# EAGLE design Intar_RGB_Module (EAGLE 7.3.0)
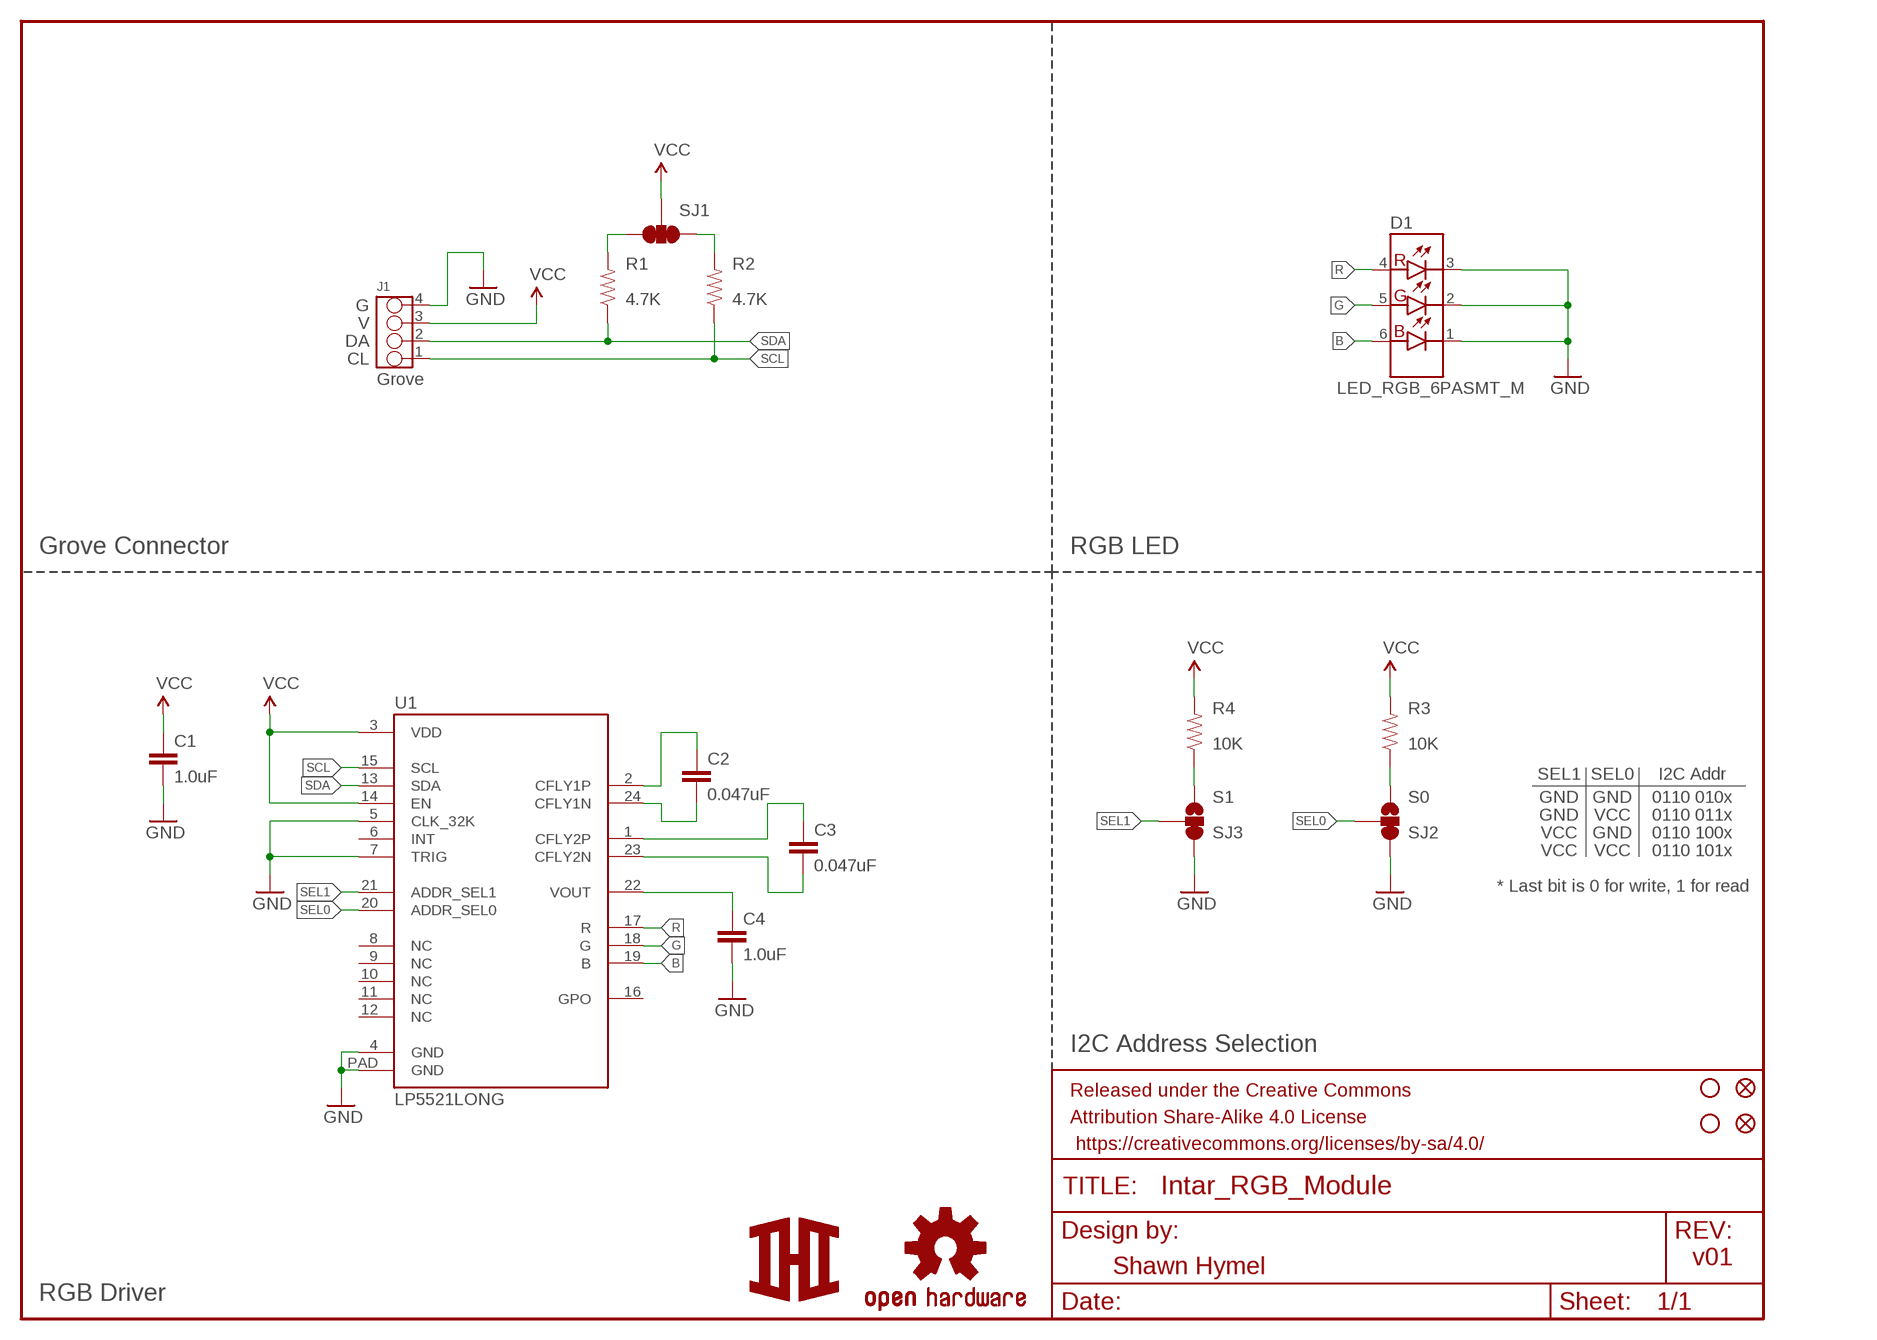
[diagram p0: schematic, sheet 1]

## Parts
C1  1.0uF  1.0UF-16V-10%(0603)  [0603-CAP]
C2  0.047uF  CAP0603-CAP  [0603-CAP]
C3  0.047uF  CAP0603-CAP  [0603-CAP]
C4  1.0uF  1.0UF-16V-10%(0603)  [0603-CAP]
D1  LED_RGB_6PASMT_M  [ASMT-YTB7-0AA02_M]
FID1  FIDUCIAL1X2  [FIDUCIAL-1X2]
FID2  FIDUCIAL1X2  [FIDUCIAL-1X2]
FRAME1  FRAME-LETTER  [CREATIVE_COMMONS]
J1  GROVE-4P-2.0-3470130P1  [4P-2.0]
LOGO1  OSHW-LOGOS  [OSHW-LOGO-S]
R1  4.7K  4.7KOHM-1/10W-1%(0603)  [0603-RES]
R2  4.7K  4.7KOHM-1/10W-1%(0603)  [0603-RES]
R3  10K  10KOHM-1/10W-1%(0603)0603  [0603-RES]
R4  10K  10KOHM-1/10W-1%(0603)0603  [0603-RES]
SJ1  SOLDERJUMPER_2WAYPASTE1&2&3  [SJ_3_PASTE1&2&3]
SJ2  SOLDERJUMPER_2WAYPASTE2&3  [SJ_3_PASTE2&3]
SJ3  SOLDERJUMPER_2WAYPASTE2&3  [SJ_3_PASTE2&3]
STANDOFF1  STAND-OFF  [STAND-OFF]
STANDOFF2  STAND-OFF  [STAND-OFF]
U1  LP5521LONG  [WQFN-24_LONG]
U$1  LOGOSM  [LOGO_SM]

## Nets
B: D1.6(B_A) U1.19(B)
G: D1.5(G_A) U1.18(G)
GND: C1.2 C4.2 D1.1(B_C) D1.2(G_C) D1.3(R_C) J1.4 SJ2.3 SJ3.3 U1.4(GND) U1.5(CLK_32K) U1.7(TRIG) U1.PAD(GND)
N$1: C2.1 U1.2(CFLY1P)
N$2: C2.2 U1.24(CFLY1N)
N$3: C3.1 U1.1(CFLY2P)
N$4: C3.2 U1.23(CFLY2N)
N$5: C4.1 U1.22(VOUT)
N$6: R1.2 SJ1.3
N$7: R2.2 SJ1.1
N$9: R3.1 SJ2.1
N$10: R4.1 SJ3.1
R: D1.4(R_A) U1.17(R)
SCL: J1.1 R2.1 U1.15(SCL)
SDA: J1.2 R1.1 U1.13(SDA)
SEL0: SJ2.2 U1.20(ADDR_SEL0)
SEL1: SJ3.2 U1.21(ADDR_SEL1)
VCC: C1.1 J1.3 R3.2 R4.2 SJ1.2 U1.3(VDD) U1.14(EN)
Unconnected: U1.6(INT) U1.8(NC) U1.9(NC) U1.10(NC) U1.11(NC) U1.12(NC) U1.16(GPO)

## Notes on the sheet
- G
- V
- DA
- CL
- Grove
- Grove Connector | RGB LED
- SEL1 | SEL0 | I2C Addr
- S1 | S0 | GND | GND | 0110 010x
- GND | VCC | 0110 011x
- VCC | GND | 0110 100x
- VCC | VCC | 0110 101x
- * Last bit is 0 for write, 1 for read
- I2C Address Selection
- v01
- Shawn Hymel
- RGB Driver

## Library data of the parts
C1 C4 = SparkFun-Capacitors:1.0UF-16V-10%(0603): CAP-00868; PROD_ID: CAP-00868
C2 C3 = SparkFun-Capacitors:CAP: Capacitor Standard 0603 ceramic capacitor, and 0.1" leaded capacitor.
D1 = Intar_Eagle_Library:LED_RGB_6P
FID1 FID2 = SparkFun-Aesthetics:FIDUCIAL: Fiducial Alignment Points Various fiducial points for machine vision alignment.
FRAME1 = SparkFun-Aesthetics:FRAME-LETTER: Schematic Frame Standard 8.5x11 US Letter frame
J1 = Connector:GROVE-4P-2.0
LOGO1 = SparkFun-Aesthetics:OSHW-LOGO: Open Source Hardware Logo This logo indicates the piece of hardware it is found on incorporates a OSHW license and/or adheres to the definition of open source hardware found here: http://freedomdefined.org/OSHW
R1 R2 = SparkFun-Resistors:4.7KOHM-1/10W-1%(0603): RES-07857; PROD_ID: RES-07857
R3 R4 = SparkFun-Resistors:10KOHM-1/10W-1%(0603): RES-00824; PROD_ID: RES-00824
SJ1-SJ3 = SparkFun-Retired:SOLDERJUMPER_2WAY: Solder Jumper 2 way solder jumper
STANDOFF1 STANDOFF2 = SparkFun-Electromechanical:STAND-OFF: #4 Stand Off This is the mechanical footprint for a #4 phillips button head screw. Use the keepout ring to avoid running the screw head into surrounding components. SKU : PRT-00447
U1 = Intar_Eagle_Library:LP5521
U$1 = Intar_Eagle_Library:LOGO

## Board
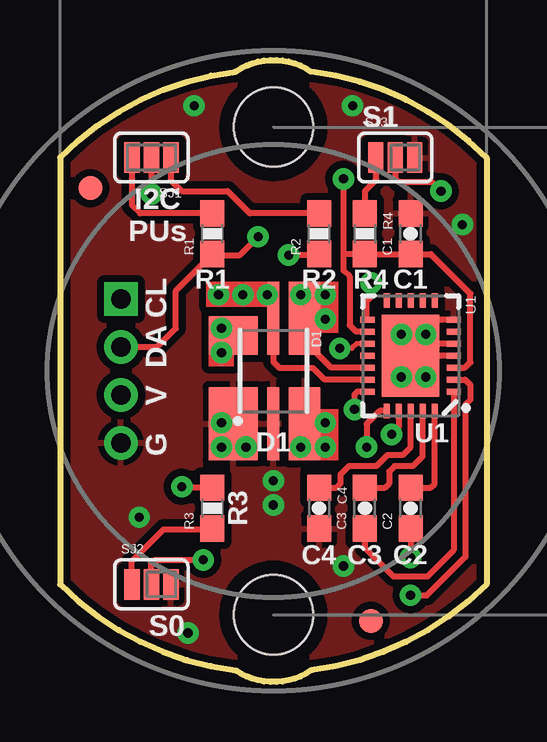
[diagram p1: board, top side]
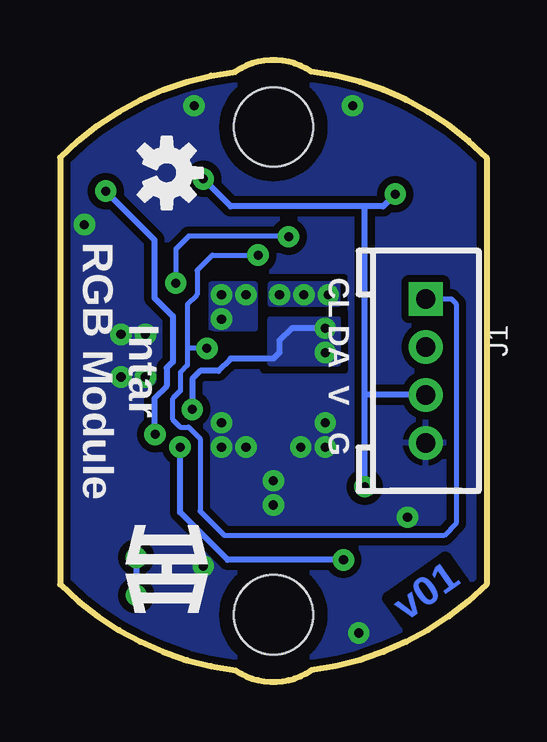
[diagram p2: board, bottom side, seen from below]

Size 17.78 x 25.91 mm. Coordinates in mm from the lower left corner, seen from the top.
Outline: 17.78,21.85 17.78,4.07 arc-38 10.46,0.48 arc-69 7.32,0.48 arc-38 0,4.07 0,21.85 arc-38 7.32,25.43 arc-69 10.46,25.43 arc-38 17.78,21.85
Copper layers (1*16): Top 0.035mm / dielectric 1.5mm / Bottom 0.035mm
Design rules "SparkFun-2-layer": minimum track width 7mil, minimum drill 15mil, track to track 8mil, track to pad 8mil, pad to pad 8mil, via to via 8mil, smd to smd 8mil, copper to edge 8mil, drill to drill 8mil, minimum pad ring 12mil, minimum via ring 10mil, stop-mask expansion 4mil, vias tented up to drill 20mil, thermal gap 10mil
tRestrict: area 16.2,13.8 to 16.6,13.9

### Footprints (pad centres in the part's own frame; a part is rotated, then mirrored left to right if it is on the bottom)
0603-CAP = smd 1.1 x 1: 1 -0.85,0; 2 0.85,0
ASMT-YTB7-0AA02_M = smd 3.05 x 2.05: 1 2.2,-1.675 | smd 3.05 x 0.5: 2 2.2,0; 5 -2.2,0 | smd 3.05 x 1.3: 3 2.2,1.3; 4 -2.2,1.3 | smd 1.6 x 2.05: 6 -1.475,-1.675
FIDUCIAL-1X2 = smd 1 x 1: 1 0,0
4P-2.0 = drill 0.8 pad 1.27 square: 1 -3,0 | drill 0.8 pad 1.27: 2 -1,0; 3 1,0; 4 3,0
0603-RES = smd 1.1 x 1: 1 -0.85,0; 2 0.85,0
SJ_3_PASTE1&2&3 = smd 0.635 x 1.27: 1 -0.813,0; 2 0,0; 3 0.813,0
SJ_3_PASTE2&3 = smd 0.635 x 1.27: 1 -0.813,0; 2 0,0; 3 0.813,0
STAND-OFF = hole 3.302: 0,0
WQFN-24_LONG = smd 0.25 x 0.6: 1 1.5,1.8; 2 1,1.8; 3 0.5,1.8; 4 0,1.8; 5 -0.5,1.8; 6 -1,1.8; 7 -1.5,1.8; 13 -1.5,-1.8; 14 -1,-1.8; 15 -0.5,-1.8; 16 0,-1.8; 17 0.5,-1.8; 18 1,-1.8; 19 1.5,-1.8 | smd 0.6 x 0.25: 8 -2.3,1; 9 -2.3,0.5; 10 -2.3,0; 11 -2.3,-0.5; 12 -2.3,-1; 20 2.3,-1; 21 2.3,-0.5; 22 2.3,0; 23 2.3,0.5; 24 2.3,1 | smd 3.4 x 2.4: PAD 0,0

### Placement (x,y rotation side)
C1  14.61,18.67 90 top
C2  14.61,7.24 90 top
C3  12.7,7.24 90 top
C4  10.79,7.24 270 top
D1  8.89,12.96 270 top
FID1  1.27,20.58 0 top
FID2  12.95,2.54 0 top
FRAME1  -24.13,-9.9 0 top  (outside the outline)
J1  2.54,12.96 270 bottom
LOGO1  13.34,21.21 270 bottom
R1  6.35,18.67 90 top
R2  10.79,18.67 90 top
R3  6.35,7.24 90 top
R4  12.7,18.67 270 top
SJ1  3.81,21.85 180 top
SJ2  3.81,4.07 0 top
SJ3  13.97,21.85 0 top
STANDOFF1  8.89,23.12 0 top
STANDOFF2  8.89,2.8 0 top
U1  14.61,13.59 270 top
U$1  13.34,4.7 270 bottom

### Tracks (layer width: path | path; a pad name or v marks a point on that pad's centre or on a via)
B  (via drill 0.38)
  Top 0.254: D1.6 7.03,14.43 v6.73,14.73 | U1.19 12.39,12.09 12.27,11.96 v12.27,11.36
  Bottom 0.254: v6.73,14.73 8.13,14.73 8.64,14.23 8.64,13.72 8.89,13.46 10.67,13.46 11.18,12.96 11.94,12.96 12.27,12.63 v12.27,11.36
  other vias: 6.73,13.72
  pour Bottom (isolate 0.305, rank 2): 6.2,13.26 9.02,13.26 9.02,15.11 6.2,15.11
G  (via drill 0.38)
  Top 0.254: v8.64,16.13 8.89,15.88 D1.5 8.89,13.34 9.14,13.08 10.54,13.08 11.03,12.59 U1.18
  other vias: 7.62,16.13 6.6,16.13
  pour Bottom (isolate 0.305, rank 2): 6.2,16.56 9.02,16.56 9.02,15.75 6.2,15.75
GND  (via drill 0.38)
  Top 0.254: U1.7 14.99,15.09 14.94,15.04 14.94,14.48 15.32,14.09 | U1.4 U1.PAD 15.11,14.09 15.32,14.09 | U1.5 15.32,14.09 | D1.3 11.01,10.76 v11.05,10.8
  other vias: 6.73,10.8 6.73,9.78 7.75,9.78 11.05,9.78 10.03,9.78 8.89,8.38 8.89,7.37 15.24,14.48 14.22,14.48 15.24,12.7 14.22,12.7 3.3,6.86 11.81,4.83 5.59,24 12.19,24 16.76,19.05 5.33,2.03
  pour Bottom (isolate 0.305, rank 4): 0,26.93 17.78,26.93 17.78,-1.01 0,-1.01
  pour Top (isolate 0.305): 0,26.93 17.78,26.93 17.78,-1.01 0,-1.01
N$1  (via drill 0.38)
  Top 0.254: U1.2 16.88,12.59 17.09,12.37 17.09,11.76 16.89,11.56 16.89,5.21 15.29,3.61 v14.61,3.61 | C2.1 v14.61,5.18
  Bottom 0.254: v14.61,5.18 v14.61,3.61
N$2
  Top 0.254: C2.2 15.46,8.09 15.61,8.24 U1.24
N$3
  Top 0.254: U1.1 16.41,5.48 15.32,4.4 13.89,4.4 12.7,5.59 C3.1
N$4
  Top 0.254: C3.2 13.55,8.09 13.72,8.26 13.72,8.76 13.95,8.99 14.71,8.99 15.11,9.39 U1.23
N$5
  Top 0.254: C4.1 11.52,8.09 11.68,8.26 11.68,8.64 12.04,8.99 13.18,8.99 13.64,9.45 14.28,9.45 14.61,9.78 U1.22
N$6
  Top 0.254: SJ1.3 3,19.86 3.34,19.52 R1.2
N$7
  Top 0.254: R2.2 7.91,19.52 6.99,20.45 5.08,20.45 4.62,20.91 SJ1.1
N$9
  Top 0.254: SJ2.1 3,5.03 4.32,6.35 6.31,6.35 R3.1
N$10
  Top 0.254: SJ3.1 13.16,20.91 12.7,20.45 R4.1
R  (via drill 0.38)
  Top 0.254: v11.05,15.11 10.23,15.11 D1.4 10.16,15.13 10.16,14.23 11.29,13.09 U1.17
  other vias: 11.05,16.13 10.03,16.13
  pour Bottom (isolate 0.305, rank 2): 9.65,16.56 11.48,16.56 11.48,14.73 9.65,14.73
SCL  (via drill 0.38)
  Top 0.203: U1.15 12.36,14.09 12.17,13.9 v11.66,13.9
  Top 0.254: R2.1 10.76,17.78 v9.53,17.78
  Bottom 0.203: v9.53,17.78 11.43,17.78 12.07,17.15 12.07,16.13 12.47,15.72 12.47,13.95 | 12.47,13.95 12.47,13.18 12.75,12.9 12.75,12.14 13.08,11.81 13.08,10.92 12.78,10.62 12.42,10.62 11.94,10.14 11.94,7.11 10.92,6.1 5.59,6.1 1.78,6.1 1.27,6.61 1.27,15.75 1.48,15.96 J1.1 | 12.47,13.95 12.42,13.9 v11.66,13.9
SDA  (via drill 0.38)
  Top 0.203: U1.13 12.8,15.85 12.95,16 v12.95,16.61
  Top 0.254: v8.26,18.54 7.49,17.78 6.39,17.78 R1.1 4.83,16.3 4.83,14.73 4.05,13.96 J1.2
  Bottom 0.203: 8.28,18.57 12.42,18.57 12.95,18.04 v12.95,16.61
  Bottom 0.254: 8.28,18.57 v8.26,18.54
SEL0  (via drill 0.38)
  Top 0.254: U1.20 13.32,11.29 12.78,10.75 v12.78,9.78 | SJ2.2 3.81,4.95 3.94,5.08 v5.97,5.08
  Bottom 0.254: v5.97,5.08 10.79,5.08 12.78,7.06 v12.78,9.78
SEL1  (via drill 0.38)
  Top 0.254: SJ3.2 13.97,20.96 14.1,20.83 15.49,20.83 v15.88,20.45 | U1.21 14.11,10.6 v13.82,10.31
  Bottom 0.254: v15.88,20.45 13.84,18.42 13.84,16 13.08,15.24 13.08,13.34 13.34,13.08 13.34,12.32 13.84,11.81 13.84,10.34 v13.82,10.31
VCC  (via drill 0.38)
  Top 0.254: SJ1.2 v3.81,20.32 | U1.14 12.34,14.59 12.07,14.86 12.07,16.89 11.81,17.15 11.81,17.78 | U1.3 16.87,13.09 17.09,13.31 17.09,16.18 15.46,17.82 C1.1 R4.2 11.85,17.82 11.81,17.78 | R3.2 5.12,8.09 v5.08,8.13 | v11.81,20.96 11.81,17.78
  Bottom 0.254: 5.08,19.81 4.32,19.81 v3.81,20.32 | 5.08,19.81 10.67,19.81 v11.81,20.96 | v5.08,8.13 5.08,11.94 | 5.08,11.94 5.08,19.81 | J1.3 5.06,11.96 5.08,11.94

### Text on the board
Bottom: v01
tPlace: S1 | I2C / PUs | CL | R1 | R2 | R4 | C1 | DA | V | U1 | G | D1 | R3 | C4 | C3 | C2 | S0
bPlace: CL | DA | Intar / RGB Module | V | G
tDocu: Shawn Hymel